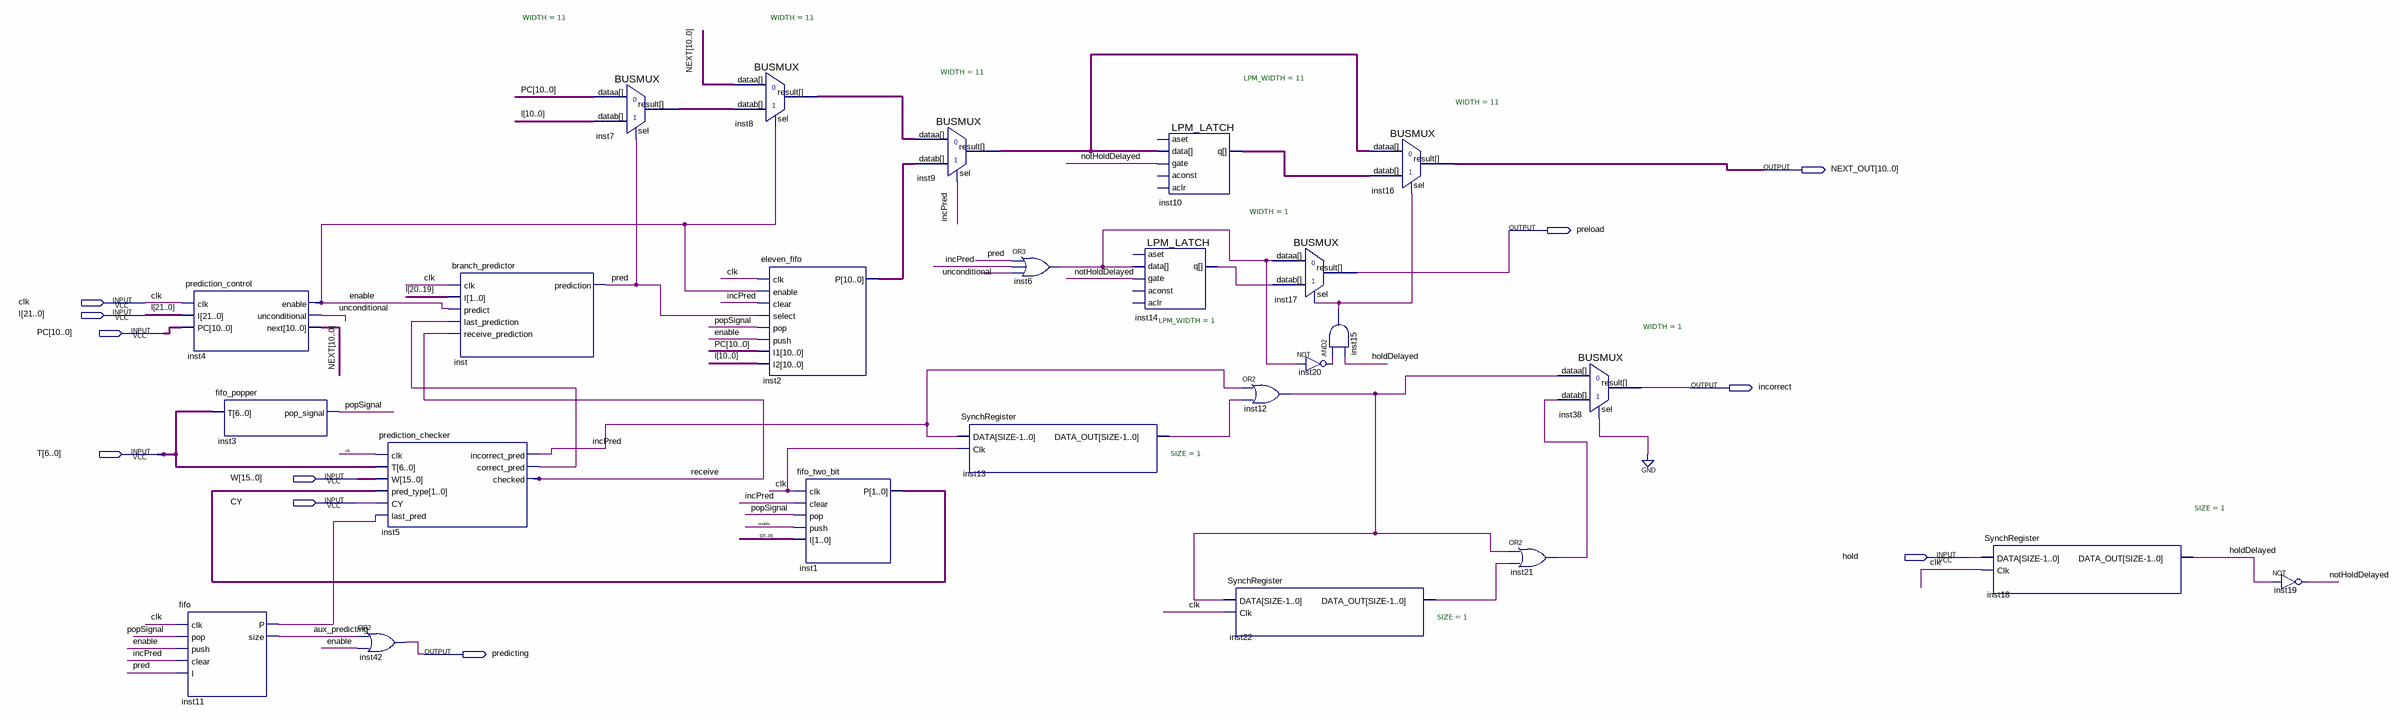
[diagram p0: schematic sheet]
// Quartus schematic prediction_block.bdf as structural Verilog: 25 symbols, 11 pins
module prediction_block (
  input  clk,
  input  [21:0] I,
  input  [10:0] PC,
  input  [6:0] T,
  input  [15:0] W,
  input  CY,
  input  hold,
  output [10:0] NEXT_OUT,
  output preload,
  output incorrect,
  output predicting
);

  wire aux_predicting, enable, holdDelayed, incPred, inst5_correct_pred, inst6_out, inst11_p, inst12_out,
       inst13_data_out, inst14_q, inst15_out, inst20_out, inst21_out, inst22_data_out, notHoldDelayed,
       popSignal, pred, receive, unconditional;
  wire [1:0] inst1_p;
  wire [10:0] inst2_p, inst7_result, inst8_result, inst9_result, inst10_q, NEXT;

  fifo inst11 (
    .clk(clk), .pop(popSignal), .push(enable), .clear(incPred), .I(pred), .P(inst11_p), .size(aux_predicting));
  prediction_control inst4 (.clk(clk), .I(I), .PC(PC), .enable(enable), .unconditional(unconditional), .next(NEXT));
  fifo_popper inst3 (.T(T), .pop_signal(popSignal));
  or inst42 (predicting, aux_predicting, enable);
  prediction_checker inst5 (
    .clk(clk), .T(T), .W(W), .pred_type(inst1_p), .CY(CY), .last_pred(inst11_p), .incorrect_pred(incPred),
    .correct_pred(inst5_correct_pred), .checked(receive));
  branch_predictor inst (
    .clk(clk), .I(I[20:19]), .predict(enable), .last_prediction(inst5_correct_pred),
    .receive_prediction(receive), .prediction(pred));
  BUSMUX #(.WIDTH(11)) inst7 (.datab(I[10:0]), .sel(pred), .dataa(PC), .result(inst7_result));
  BUSMUX #(.WIDTH(11)) inst8 (.datab(inst7_result), .sel(enable), .dataa(NEXT), .result(inst8_result));
  eleven_fifo inst2 (
    .clk(clk), .enable(enable), .clear(incPred), .select(pred), .pop(popSignal), .push(enable), .I1(PC),
    .I2(I[10:0]), .P(inst2_p));
  fifo_two_bit inst1 (.clk(clk), .clear(incPred), .pop(popSignal), .push(enable), .I(I[20:19]), .P(inst1_p));
  BUSMUX #(.WIDTH(11)) inst9 (.datab(inst2_p), .sel(incPred), .dataa(inst8_result), .result(inst9_result));
  SynchRegister #(.SIZE(1)) inst13 (.DATA(incPred), .Clk(clk), .DATA_OUT(inst13_data_out));
  or inst6 (inst6_out, pred, incPred, unconditional);
  LPM_LATCH #(.LPM_WIDTH(1)) inst14 (
    .data(inst6_out), .gate(notHoldDelayed), .q(inst14_q));  // open: aset, aconst, aclr
  LPM_LATCH #(.LPM_WIDTH(11)) inst10 (
    .data(inst9_result), .gate(notHoldDelayed), .q(inst10_q));  // open: aset, aconst, aclr
  or inst12 (inst12_out, incPred, inst13_data_out);
  SynchRegister #(.SIZE(1)) inst22 (.DATA(inst12_out), .Clk(clk), .DATA_OUT(inst22_data_out));
  BUSMUX #(.WIDTH(1)) inst17 (.datab(inst14_q), .sel(inst15_out), .dataa(inst6_out), .result(preload));
  and inst15 (inst15_out, inst20_out, holdDelayed);
  not inst20 (inst20_out, inst6_out);
  BUSMUX #(.WIDTH(11)) inst16 (.datab(inst10_q), .sel(inst15_out), .dataa(inst9_result), .result(NEXT_OUT));
  or inst21 (inst21_out, inst12_out, inst22_data_out);
  BUSMUX #(.WIDTH(1)) inst38 (.datab(inst21_out), .sel(1'b0), .dataa(inst12_out), .result(incorrect));
  SynchRegister #(.SIZE(1)) inst18 (.DATA(hold), .Clk(clk), .DATA_OUT(holdDelayed));
  not inst19 (notHoldDelayed, holdDelayed);
endmodule
